# Altium schematic sheet TMC2100-TA-T_Breakout.SchDoc
size A4; SheetNumber: 1; SheetTotal: 1
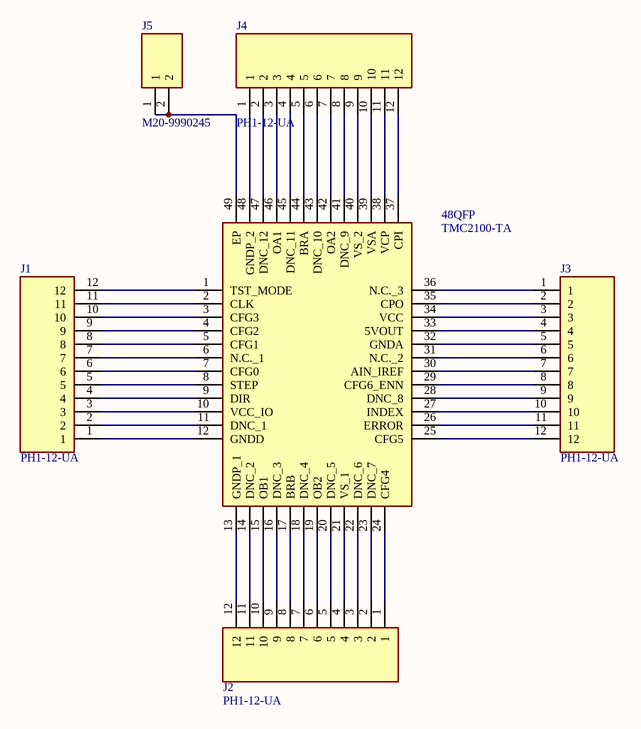
[diagram p0: TMC2100-TA-T_Breakout.SchDoc]

## Parts
48QFP  TMC2100-TA  [QFP50P900X900X120-49N]
J1  PH1-12-UA  [HDRV12W64P0X254_1X12_3048X250X847P]
J2  PH1-12-UA  [HDRV12W64P0X254_1X12_3048X250X847P]
J3  PH1-12-UA  [HDRV12W64P0X254_1X12_3048X250X847P]
J4  PH1-12-UA  [HDRV12W64P0X254_1X12_3048X250X847P]
J5  M20-9990245  [HDRV2W64P0X254_1X2_508X254X864P]

## Nets
Net48QFP_1: 48QFP.1(TST_MODE) J1.12
Net48QFP_2: 48QFP.2(CLK) J1.11
Net48QFP_3: 48QFP.3(CFG3) J1.10
Net48QFP_4: 48QFP.4(CFG2) J1.9
Net48QFP_5: 48QFP.5(CFG1) J1.8
Net48QFP_6: 48QFP.6(N.C._1) J1.7
Net48QFP_7: 48QFP.7(CFG0) J1.6
Net48QFP_8: 48QFP.8(STEP) J1.5
Net48QFP_9: 48QFP.9(DIR) J1.4
Net48QFP_10: 48QFP.10(VCC_IO) J1.3
Net48QFP_11: 48QFP.11(DNC_1) J1.2
Net48QFP_12: 48QFP.12(GNDD) J1.1
Net48QFP_13: 48QFP.13(GNDP_1) J2.12
Net48QFP_14: 48QFP.14(DNC_2) J2.11
Net48QFP_15: 48QFP.15(OB1) J2.10
Net48QFP_16: 48QFP.16(DNC_3) J2.9
Net48QFP_17: 48QFP.17(BRB) J2.8
Net48QFP_18: 48QFP.18(DNC_4) J2.7
Net48QFP_19: 48QFP.19(OB2) J2.6
Net48QFP_20: 48QFP.20(DNC_5) J2.5
Net48QFP_21: 48QFP.21(VS_1) J2.4
Net48QFP_22: 48QFP.22(DNC_6) J2.3
Net48QFP_23: 48QFP.23(DNC_7) J2.2
Net48QFP_24: 48QFP.24(CFG4) J2.1
Net48QFP_25: 48QFP.25(CFG5) J3.12
Net48QFP_26: 48QFP.26(ERROR) J3.11
Net48QFP_27: 48QFP.27(INDEX) J3.10
Net48QFP_28: 48QFP.28(DNC_8) J3.9
Net48QFP_29: 48QFP.29(CFG6_ENN) J3.8
Net48QFP_30: 48QFP.30(AIN_IREF) J3.7
Net48QFP_31: 48QFP.31(N.C._2) J3.6
Net48QFP_32: 48QFP.32(GNDA) J3.5
Net48QFP_33: 48QFP.33(5VOUT) J3.4
Net48QFP_34: 48QFP.34(VCC) J3.3
Net48QFP_35: 48QFP.35(CPO) J3.2
Net48QFP_36: 48QFP.36(N.C._3) J3.1
Net48QFP_37: 48QFP.37(CPI) J4.12
Net48QFP_38: 48QFP.38(VCP) J4.11
Net48QFP_39: 48QFP.39(VSA) J4.10
Net48QFP_40: 48QFP.40(VS_2) J4.9
Net48QFP_41: 48QFP.41(DNC_9) J4.8
Net48QFP_42: 48QFP.42(OA2) J4.7
Net48QFP_43: 48QFP.43(DNC_10) J4.6
Net48QFP_44: 48QFP.44(BRA) J4.5
Net48QFP_45: 48QFP.45(DNC_11) J4.4
Net48QFP_46: 48QFP.46(OA1) J4.3
Net48QFP_47: 48QFP.47(DNC_12) J4.2
Net48QFP_48: 48QFP.48(GNDP_2) J4.1
Net48QFP_49: 48QFP.49(EP) J5.1 J5.2

## Library data of the parts
48QFP = TMC2100-TA: Integrated Circuit; Manufacturer_Name: Analog Devices; Datasheet Link: https://www.analog.com/media/en/technical-documentation/data-sheets/TMC2100_datasheet_rev1.13.pdf; Height: 1.2mm; Manufacturer_Part_Number: TMC2100-TA; Mouser Part Number: 700-TMC2100TA; Mouser Price/Stock: https://www.mouser.co.uk/ProductDetail/ADI-Trinamic/TMC2100-TA?qs=TiOZkKH1s2TKxin%252BmphkEw%3D%3D
J1-J4 = PH1-12-UA: Connector; Manufacturer_Name: Adam Tech; Datasheet Link: https://www.arrow.com/en/products/ph1-12-ua/adam-tech?region=nac; Height: 8.469mm; Manufacturer_Part_Number: PH1-12-UA; Mouser Part Number: 737-PH1-12-UA; Mouser Price/Stock: https://www.mouser.co.uk/ProductDetail/Adam-Tech/PH1-12-UA?qs=HoCaDK9Nz5f4jFrqzX%252Bs7Q%3D%3D; Arrow Part Number: PH1-12-UA; Arrow Price/Stock: https://www.arrow.com/en/products/ph1-12-ua/adam-tech?region=nac
J5 = M20-9990245: Connector; Manufacturer_Name: Harwin; Datasheet Link: https://cdn.harwin.com/pdfs/M20-999.pdf; Height: 8.64mm; Manufacturer_Part_Number: M20-9990245; Mouser Part Number: 855-M20-9990245; Mouser Price/Stock: https://www.mouser.co.uk/ProductDetail/Harwin/M20-9990245?qs=Jph8NoUxIfUDXEB%252Bi9kJRA%3D%3D